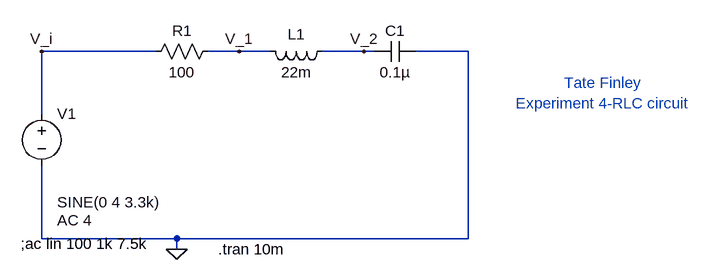
[diagram p0: schematic ECE3060_Exp4_RLC.asc]
ECE3060_Exp4_RLC.asc, the LTspice schematic file:
Version 4
SHEET 1 964 680
WIRE 128 0 -48 0
WIRE 256 0 208 0
WIRE 304 0 256 0
WIRE 448 0 384 0
WIRE 464 0 448 0
WIRE 608 0 528 0
WIRE -48 96 -48 0
WIRE -48 288 -48 176
WIRE 160 288 -48 288
WIRE 608 288 608 0
WIRE 608 288 160 288
WIRE 160 304 160 288
FLAG 160 304 0
FLAG -48 0 V_i
FLAG 256 0 V_1
FLAG 448 0 V_2
SYMBOL voltage -48 80 R0
WINDOW 123 24 180 Left 2
WINDOW 39 0 0 Left 0
WINDOW 3 24 152 Left 2
SYMATTR Value2 AC 4
SYMATTR Value SINE(0 4 3.3k)
SYMATTR InstName V1
SYMBOL res 224 -16 R90
WINDOW 0 0 56 VBottom 2
WINDOW 3 32 56 VTop 2
SYMATTR InstName R1
SYMATTR Value 100
SYMBOL cap 528 -16 R90
WINDOW 0 0 32 VBottom 2
WINDOW 3 32 32 VTop 2
SYMATTR InstName C1
SYMATTR Value 0.1µ
SYMBOL ind 400 -16 R90
WINDOW 0 5 56 VBottom 2
WINDOW 3 32 56 VTop 2
SYMATTR InstName L1
SYMATTR Value 22m
TEXT -80 296 Left 2 !;ac lin 100 1k 7.5k
TEXT 816 64 Center 2 ;Tate Finley\nExperiment 4-RLC circuit
TEXT 224 304 Left 2 !.tran 10m

The netlist it stands for:
* ECE3060_Exp4_RLC.asc
V1 V_i 0 SINE(0 4 3.3k) AC 4
R1 V_1 V_i 100
C1 0 V_2 0.1µ
L1 V_2 V_1 22m
;ac lin 100 1k 7.5k
* Tate Finley
* Experiment 4-RLC circuit
.tran 10m
.backanno
.end